# Altium schematic sheet _main.SchDoc: Main
size A3; CompanyName: Nordic Semiconductor; DrawnBy: EISK; Organization: Nordic Semiconductor; Revision: 1; SheetNumber: 1; SheetTotal: 4; Version: 0.1.2; DesignStatus: Prototype; BoardTitle: nRF9160 Tracker; Time: 2
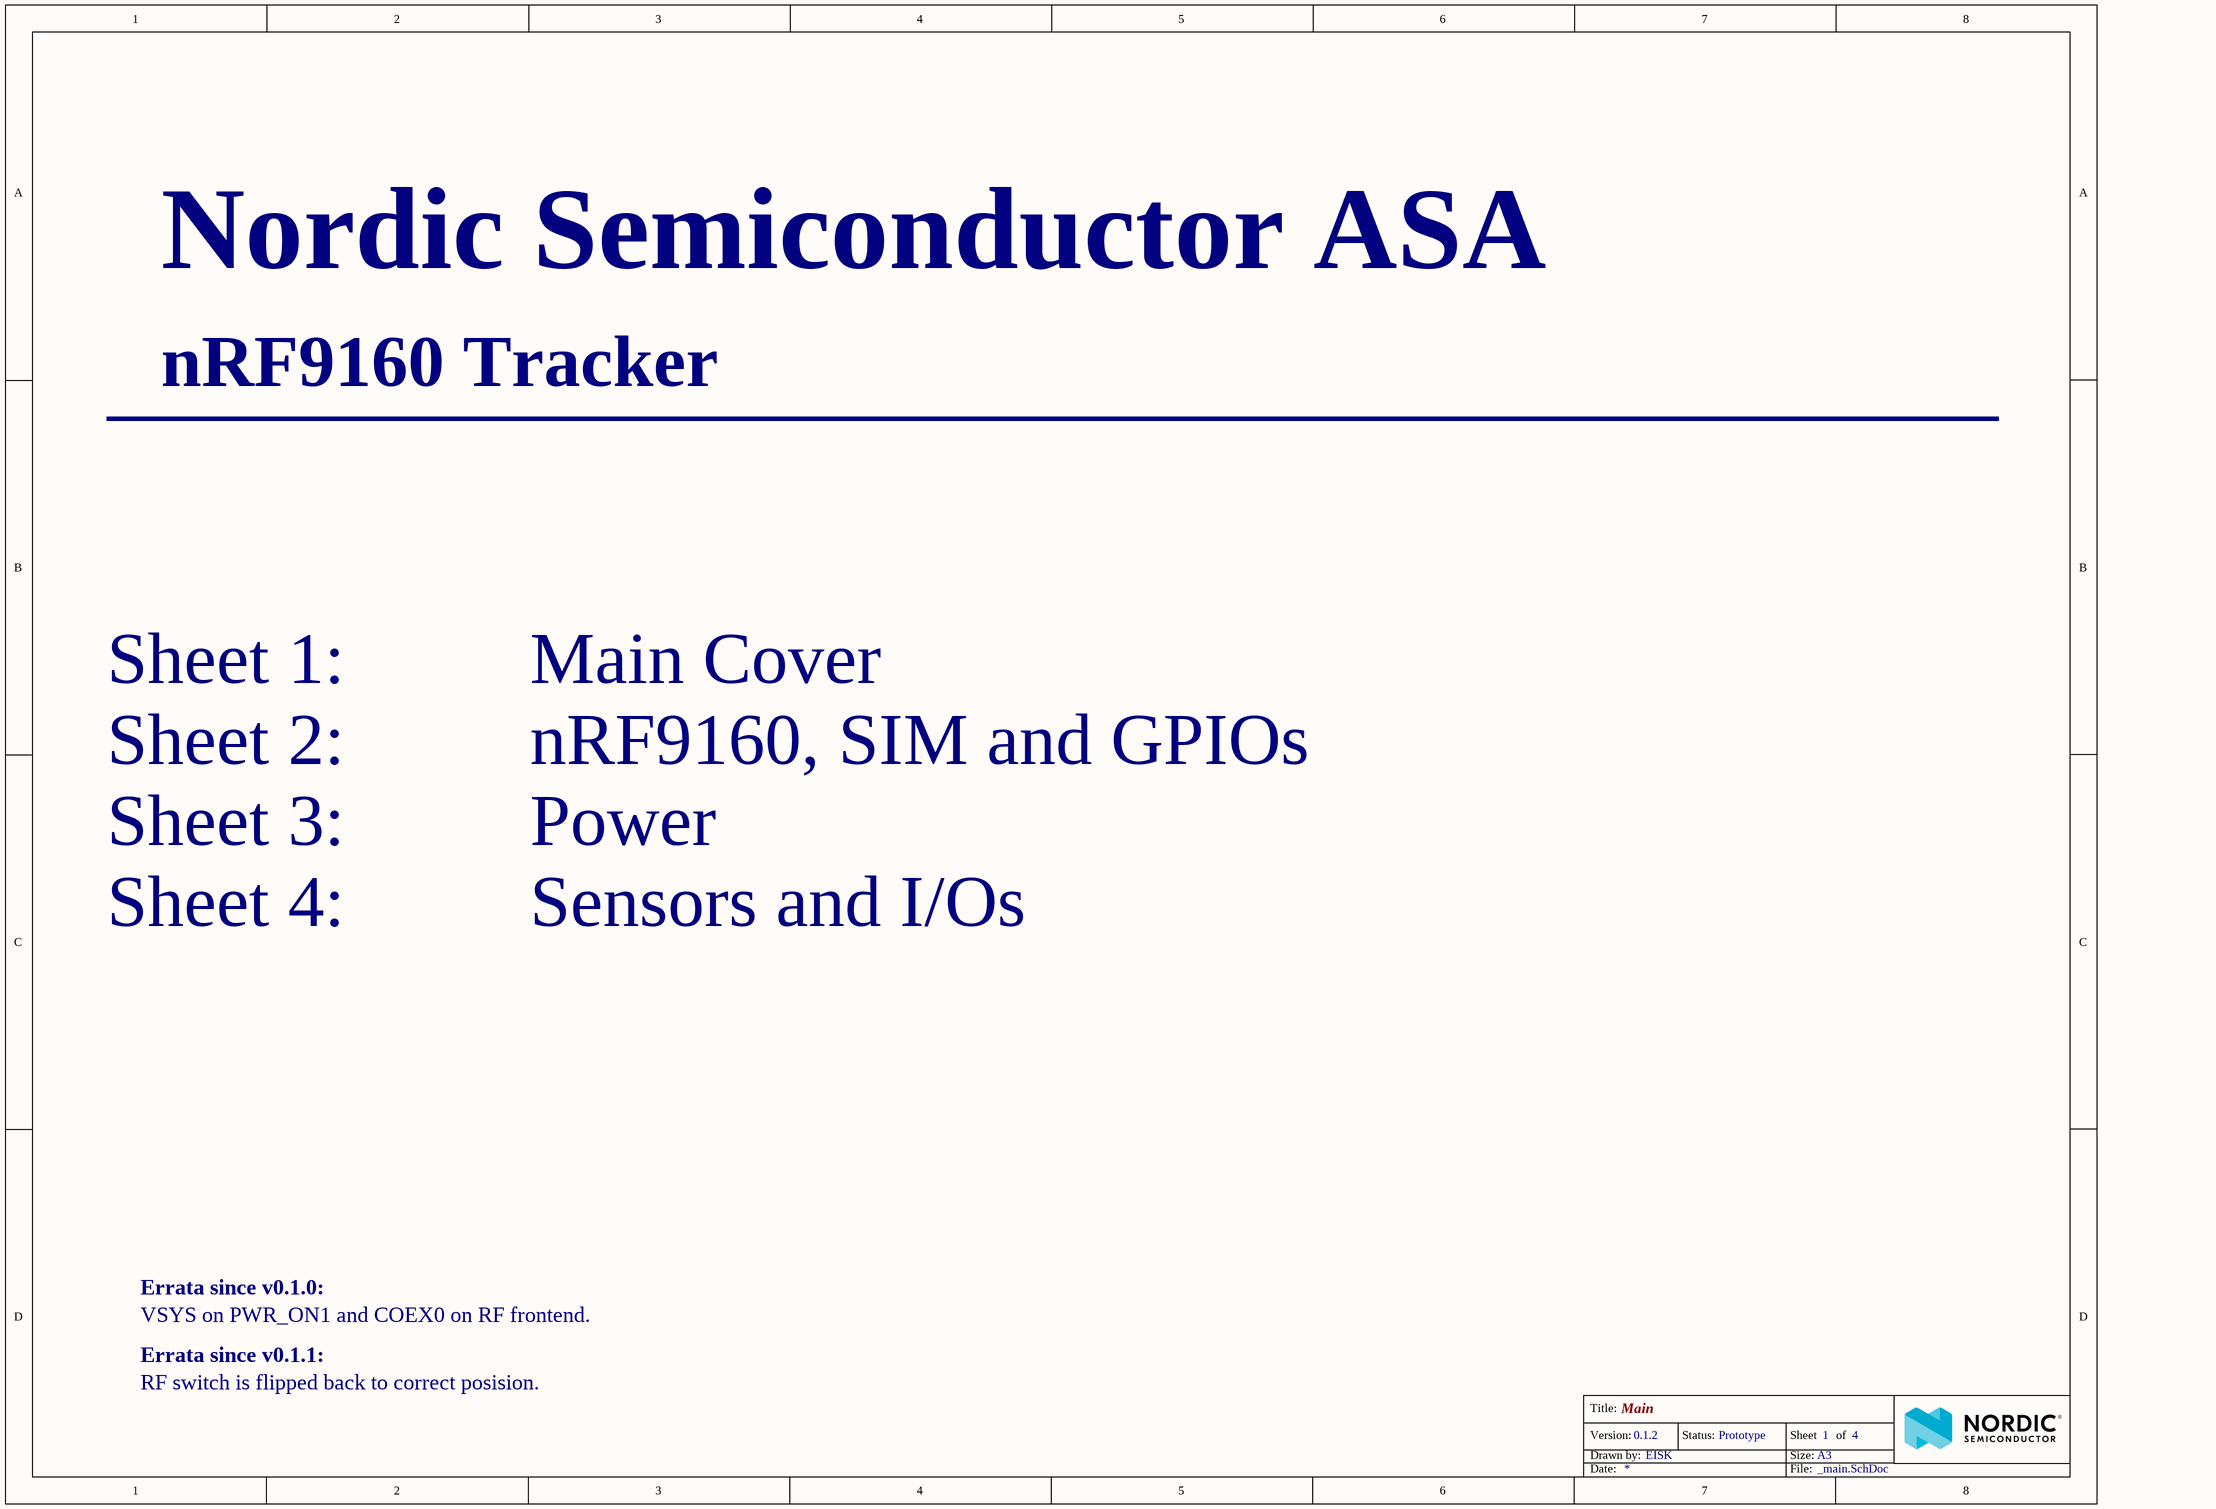
[diagram p0: _main.SchDoc]

## Notes on the sheet
- Nordic Semiconductor ASA
- ___________________________________________
- Sheet 1:          Main Cover
- Sheet 2:          nRF9160, SIM and GPIOs
- Sheet 3:          Power
- Sheet 4:          Sensors and I/Os
- Errata since v0.1.0:
- Errata since v0.1.1:
- VSYS on PWR_ON1 and COEX0 on RF frontend.
- RF switch is flipped back to correct posision.
- Title:
- Version:
- Drawn by:
- Status:
- Size:
- Sheet
- A3
- of
- Date:
- File: